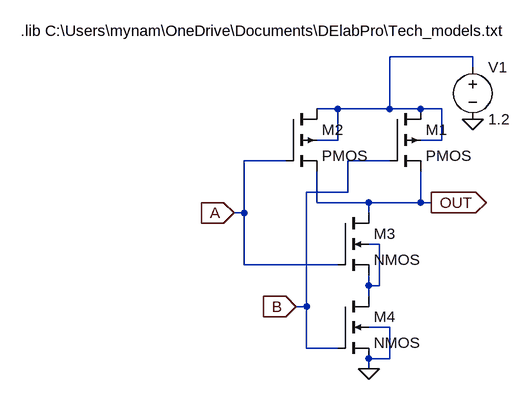
[diagram p0: schematic Nand.asc]
Nand.asc, the LTspice schematic file:
Version 4
SHEET 1 880 1016
WIRE 352 480 224 480
WIRE 352 496 352 480
WIRE 144 560 112 560
WIRE 224 560 224 480
WIRE 224 560 144 560
WIRE 272 560 224 560
WIRE 304 560 272 560
WIRE 144 608 144 560
WIRE 144 608 112 608
WIRE 304 608 304 560
WIRE 304 608 272 608
WIRE 64 640 0 640
WIRE 224 640 160 640
WIRE 160 688 160 640
WIRE 160 688 96 688
WIRE 112 704 112 656
WIRE 192 704 112 704
WIRE 272 704 272 656
WIRE 272 704 192 704
WIRE 288 704 272 704
WIRE 0 720 0 640
WIRE 0 720 -16 720
WIRE 192 720 192 704
WIRE 208 768 192 768
WIRE 0 800 0 720
WIRE 144 800 0 800
WIRE 192 832 192 816
WIRE 208 832 208 768
WIRE 208 832 192 832
WIRE 192 848 192 832
WIRE 96 864 96 688
WIRE 96 864 80 864
WIRE 224 896 192 896
WIRE 96 928 96 864
WIRE 144 928 96 928
WIRE 224 944 224 896
WIRE 224 944 192 944
WIRE 192 960 192 944
FLAG 192 960 0
FLAG -16 720 A
IOPIN -16 720 In
FLAG 80 864 B
IOPIN 80 864 In
FLAG 288 704 OUT
IOPIN 288 704 Out
FLAG 352 576 0
SYMBOL pmos4 224 560 R0
SYMATTR InstName M1
SYMATTR Value2 l=32n w=64n
SYMBOL pmos4 64 560 R0
SYMATTR InstName M2
SYMATTR Value2 l=32n w=64n
SYMBOL nmos4 144 720 R0
SYMATTR InstName M3
SYMATTR Value2 l=32n w=64n
SYMBOL nmos4 144 848 R0
SYMATTR InstName M4
SYMATTR Value2 l=32n w=64n
SYMBOL voltage 352 480 R0
SYMATTR InstName V1
SYMATTR Value 1.2
TEXT -344 440 Left 2 !.lib C:\\Users\\mynam\\OneDrive\\Documents\\DElabPro\\Tech_models.txt

The netlist it stands for:
* Nand.asc
M1 N001 B OUT N001 PMOS l=32n w=64n
M2 N001 A OUT N001 PMOS l=32n w=64n
M3 OUT A N002 N002 NMOS l=32n w=64n
M4 N002 B 0 0 NMOS l=32n w=64n
V1 N001 0 1.2
.model NMOS NMOS
.model PMOS PMOS
.lib standard.mos
.lib C:\Users\mynam\OneDrive\Documents\DElabPro\Tech_models.txt
.backanno
.end